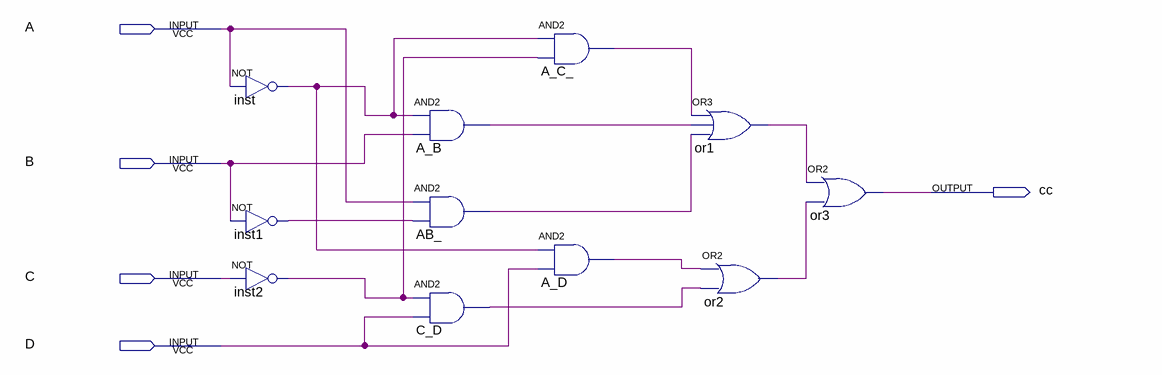
[diagram p0: schematic sheet]
// Quartus schematic output_c.bdf as structural Verilog: 11 symbols, 5 pins
module output_c (
  input  A,
  input  B,
  input  C,
  input  D,
  output cc
);

  wire A_B_out, A_C__out, A_D_out, AB__out, C_D_out, inst1_out, inst2_out, inst_out, or1_out, or2_out;

  not inst (inst_out, A);
  not inst1 (inst1_out, B);
  not inst2 (inst2_out, C);
  and A_B (A_B_out, inst_out, B);
  and AB_ (AB__out, A, inst1_out);
  and C_D (C_D_out, inst2_out, D);
  and A_C_ (A_C__out, inst_out, inst2_out);
  and A_D (A_D_out, inst_out, D);
  or or1 (or1_out, A_C__out, A_B_out, AB__out);
  or or2 (or2_out, A_D_out, C_D_out);
  or or3 (cc, or1_out, or2_out);
endmodule
